# EAGLE schematic Prototype (EAGLE 9.6.2)
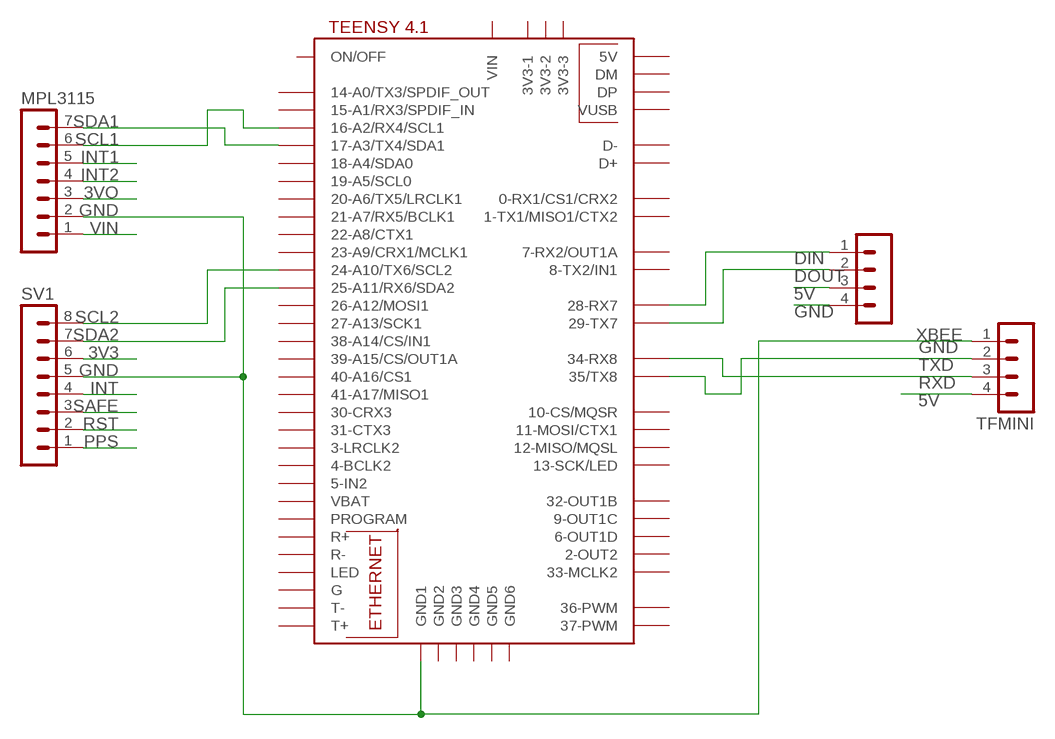
[diagram p0: schematic, sheet 1]

## Parts
MPL3115  MA07-1  [MA07-1]
SV1  MA08-1  [MA08-1]
TFMINI  MA04-1  [MA04-1]
U$1  TEENSY41  [TEENSY41]
XBEE  MA04-1  [MA04-1]

## Nets
3V3: SV1.6
3VO: MPL3115.3
5V: TFMINI.4 XBEE.3
DIN: U$1.28-RX7 XBEE.1
DOUT: U$1.29-TX7 XBEE.2
GND: MPL3115.2 SV1.5 TFMINI.1 U$1.GND1 XBEE.4
INT: SV1.4
INT1: MPL3115.5
INT2: MPL3115.4
PPS: SV1.1
RST: SV1.2
RXD: TFMINI.3 U$1.34-RX8
SAFE: SV1.3
SCL1: MPL3115.6 U$1.16-A2/RX4/SCL1
SCL2: SV1.8 U$1.24-A10/TX6/SCL2
SDA1: MPL3115.7 U$1.17-A3/TX4/SDA1
SDA2: SV1.7 U$1.25-A11/RX6/SDA2
TXD: TFMINI.2 U$1.35-TX8(35/TX8)
VIN: MPL3115.1
Unconnected: U$1.0-RX1/CS1/CRX2 U$1.1-TX1/MISO1/CTX2 U$1.2-OUT2 U$1.3-LRCLK2 U$1.3V3-1 U$1.3V3-2 U$1.3V3-3 U$1.4-BCLK2 U$1.5-IN2 U$1.6-OUT1D U$1.7-RX2/OUT1A U$1.8-TX2/IN1 U$1.9-OUT1C U$1.10-CS\MQSR(10-CS/MQSR) U$1.11-MOSI/CTX1 U$1.12-MISO/MQSL U$1.13-SCK/LED U$1.14-A0/TX3/SPDIF_OUT U$1.15-A1/RX3/SPDIF_IN U$1.18-A4/SDA0 U$1.19-A5/SCL0 U$1.20-A6/TX5/LRCLK1 U$1.21-A7/RX5/BCLK1 U$1.22-A8/CTX1 U$1.23-A9/CRX1/MCLK1 U$1.26-A12/MOSI1 U$1.27-A13/SCK1 U$1.30-CRX3 U$1.31-CTX3 U$1.32-OUT1B U$1.33-MCLK2 U$1.36-PWM U$1.37-PWM U$1.38-A14/CS/IN1 U$1.39-A15/CS/OUT1A U$1.40-A16/CS1 U$1.41-A17/MISO1 U$1.+5V(5V) U$1.D+ U$1.D- U$1.DM U$1.DP U$1.G U$1.GND2 U$1.GND3 U$1.GND4 U$1.GND5 U$1.GND6 U$1.LED U$1.ON/OFF U$1.PROGRAM U$1.R+ U$1.R- U$1.T+ U$1.T- U$1.VBAT U$1.VIN U$1.VUSB

## Library data of the parts
MPL3115 = con-lstb:MA07-1: PIN HEADER; OC_FARNELL: unknown; OC_NEWARK: unknown
SV1 = con-lstb:MA08-1: PIN HEADER; OC_FARNELL: unknown; OC_NEWARK: unknown
TFMINI XBEE = con-lstb:MA04-1: PIN HEADER; OC_FARNELL: unknown; OC_NEWARK: unknown
U$1 = teensy:TEENSY41